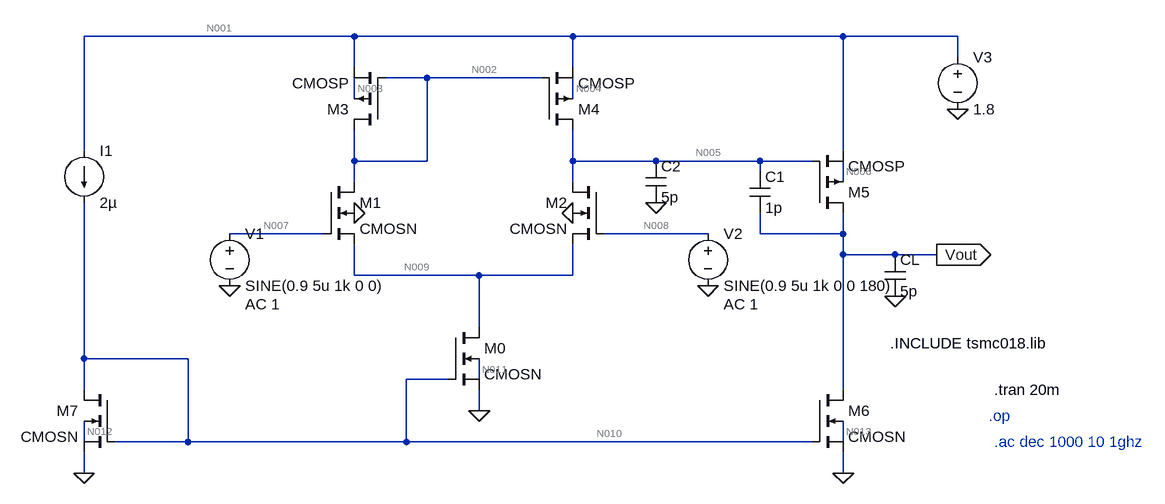
[diagram p0: schematic DC bias opamp.asc]
DC bias opamp.asc, the LTspice schematic file:
Version 4
SHEET 1 1720 680
WIRE 112 -32 -304 -32
WIRE 448 -32 112 -32
WIRE 864 -32 448 -32
WIRE 1040 -32 864 -32
WIRE 1040 0 1040 -32
WIRE 112 16 112 -32
WIRE 448 16 448 -32
WIRE 224 32 160 32
WIRE 400 32 224 32
WIRE 112 64 112 32
WIRE 448 64 448 32
WIRE -304 144 -304 -32
WIRE 864 144 864 -32
WIRE 112 160 112 112
WIRE 224 160 224 32
WIRE 224 160 112 160
WIRE 448 160 448 112
WIRE 576 160 448 160
WIRE 736 160 576 160
WIRE 816 160 736 160
WIRE 736 176 736 160
WIRE 112 192 112 160
WIRE 448 192 448 160
WIRE 864 192 864 160
WIRE 64 272 -80 272
WIRE 656 272 496 272
WIRE 736 272 736 240
WIRE 864 272 864 240
WIRE 864 272 736 272
WIRE 864 304 864 272
WIRE 944 304 864 304
WIRE 1008 304 944 304
WIRE 112 336 112 288
WIRE 304 336 112 336
WIRE 448 336 448 288
WIRE 448 336 304 336
WIRE 304 416 304 336
WIRE -304 464 -304 224
WIRE -144 464 -304 464
WIRE 256 496 192 496
WIRE 304 496 304 464
WIRE -304 512 -304 464
WIRE 864 512 864 304
WIRE 304 544 304 512
WIRE -304 592 -304 560
WIRE -144 592 -144 464
WIRE -144 592 -256 592
WIRE 192 592 192 496
WIRE 192 592 -144 592
WIRE 816 592 192 592
WIRE 864 592 864 560
WIRE -304 640 -304 608
WIRE 864 640 864 608
FLAG -80 352 0
FLAG 656 352 0
FLAG 1040 80 0
FLAG 1008 304 Vout
IOPIN 1008 304 Out
FLAG 304 544 0
FLAG 864 640 0
FLAG -304 640 0
FLAG 944 368 0
FLAG 112 240 0
FLAG 448 240 0
FLAG 576 224 0
SYMBOL cmosn 64 192 R0
SYMATTR InstName M1
SYMATTR Value2 l=1700n w=15000n
SYMBOL cmosn 496 192 M0
SYMATTR InstName M2
SYMATTR Value2 l=1700n w=15000n
SYMBOL voltage -80 256 R0
WINDOW 123 24 124 Left 2
WINDOW 39 0 0 Left 0
SYMATTR Value2 AC 1
SYMATTR InstName V1
SYMATTR Value SINE(0.9 5u 1k 0 0)
SYMBOL voltage 656 256 R0
WINDOW 123 24 124 Left 2
WINDOW 39 0 0 Left 0
SYMATTR Value2 AC 1
SYMATTR InstName V2
SYMATTR Value SINE(0.9 5u 1k 0 0 180)
SYMBOL cmosn 256 416 R0
SYMATTR InstName M0
SYMATTR Value2 l=900n w=16000n
SYMBOL cmosp 816 240 M180
SYMATTR InstName M5
SYMATTR Value2 l=900n w=18000n
SYMBOL voltage 1040 -16 R0
WINDOW 123 0 0 Left 0
WINDOW 39 0 0 Left 0
SYMATTR InstName V3
SYMATTR Value 1.8
SYMBOL cap 928 304 R0
SYMATTR InstName CL
SYMATTR Value 5p
SYMBOL cmosn -256 512 M0
SYMATTR InstName M7
SYMATTR Value2 l=900n w=1600n
SYMBOL cmosn 816 512 R0
SYMATTR InstName M6
SYMATTR Value2 l=900n w=8000n
SYMBOL current -304 144 R0
WINDOW 123 0 0 Left 0
WINDOW 39 0 0 Left 0
SYMATTR InstName I1
SYMATTR Value 2µ
SYMBOL cmosp 160 112 R180
SYMATTR InstName M3
SYMATTR Value2 l=1700n w=34000n
SYMBOL cmosp 400 112 M180
SYMATTR InstName M4
SYMATTR Value2 l=1700n w=34000n
SYMBOL cap 720 176 R0
SYMATTR InstName C1
SYMATTR Value 1p
SYMBOL cap 560 160 R0
SYMATTR InstName C2
SYMATTR Value 5p
TEXT 1088 552 Left 2 ;.op
TEXT 936 440 Left 2 !.INCLUDE tsmc018.lib
TEXT 1096 592 Left 2 ;.ac dec 1000 10 1ghz
TEXT 1096 512 Left 2 !.tran 20m

The netlist it stands for:
* DC bias opamp.asc
M1 N002 N007 N009 0 CMOSN l=1700n w=15000n
M2 N005 N008 N009 0 CMOSN l=1700n w=15000n
V1 N007 0 SINE(0.9 5u 1k 0 0) AC 1
V2 N008 0 SINE(0.9 5u 1k 0 0 180) AC 1
M0 N009 N010 0 N011 CMOSN l=900n w=16000n
M5 Vout N005 N001 N006 CMOSP l=900n w=18000n
V3 N001 0 1.8
CL Vout 0 5p
M7 N010 N010 0 N012 CMOSN l=900n w=1600n
M6 Vout N010 0 N013 CMOSN l=900n w=8000n
I1 N001 N010 2µ
M3 N002 N002 N001 N003 CMOSP l=1700n w=34000n
M4 N005 N002 N001 N004 CMOSP l=1700n w=34000n
C1 N005 Vout 1p
C2 N005 0 5p
.model NMOS NMOS
.model PMOS PMOS
.lib standard.mos
* .op
.INCLUDE tsmc018.lib
* .ac dec 1000 10 1ghz
.tran 20m
.backanno
.end

* Results of the author's LTspice run, read from the files saved beside the schematic
* Operating Point, zero values left out:
*   V(n002) = 1.314 V
*   V(n007) = 900 mV
*   V(n009) = 334.4 mV
*   V(n005) = 1.314 V
*   V(n008) = 900 mV
*   V(n010) = 478.7 mV
*   V(n011) = 69.39 mV
*   V(vout) = 300.5 mV
*   V(n001) = 1.8 V
*   V(n006) = 1.654 V
*   V(n012) = 83.17 mV
*   V(n013) = 65.27 mV
*   V(n003) = 1.664 V
*   V(n004) = 1.664 V
*   Id(M1) = 8.881 µA
*   Ib(M1) = -1.668 pA
*   Is(M1) = -8.881 µA
*   Id(M2) = 8.881 µA
*   Ib(M2) = -1.668 pA
*   Is(M2) = -8.881 µA
*   Id(M0) = 17.76 µA
*   Is(M0) = -17.76 µA
*   Id(M7) = 2 µA
*   Is(M7) = -2 µA
*   Id(M6) = 8.696 µA
*   Is(M6) = -8.696 µA
*   Id(M5) = -8.696 µA
*   Ib(M5) = -1.654 pA
*   Is(M5) = 8.696 µA
*   Id(M3) = -8.881 µA
*   Ib(M3) = -1.664 pA
*   Is(M3) = 8.881 µA
*   Id(M4) = -8.881 µA
*   Ib(M4) = -1.664 pA
*   Is(M4) = 8.881 µA
*   I(I1) = 2 µA
*   I(V3) = -28.46 µA
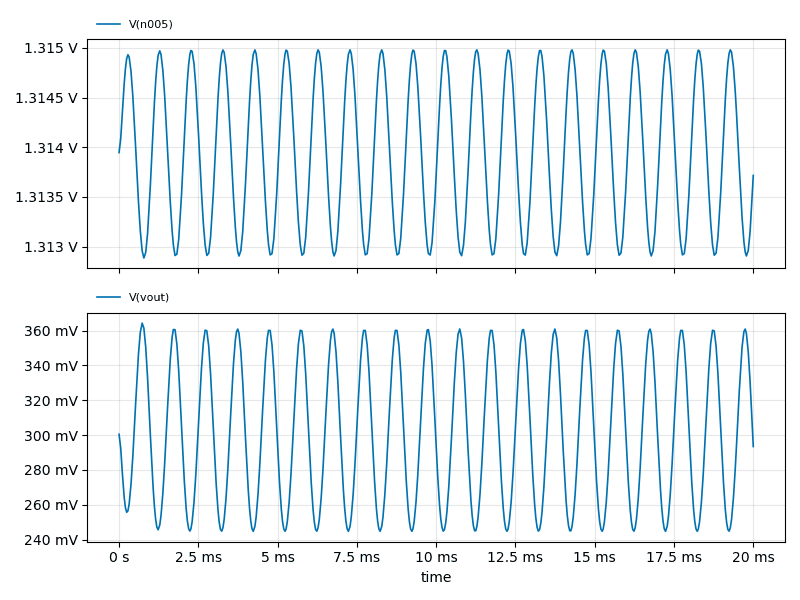
[diagram p1: Transient Analysis of DC bias opamp.asc, plotted from the saved traces]
* Transient Analysis, 1 run:
*   V(n005): min 1.313 V, max 1.315 V, average 1.314 V, rms 1.314 V, last 1.314 V
*   V(vout): min 244.8 mV, max 364.3 mV, average 301.3 mV, rms 304.2 mV, last 293.4 mV